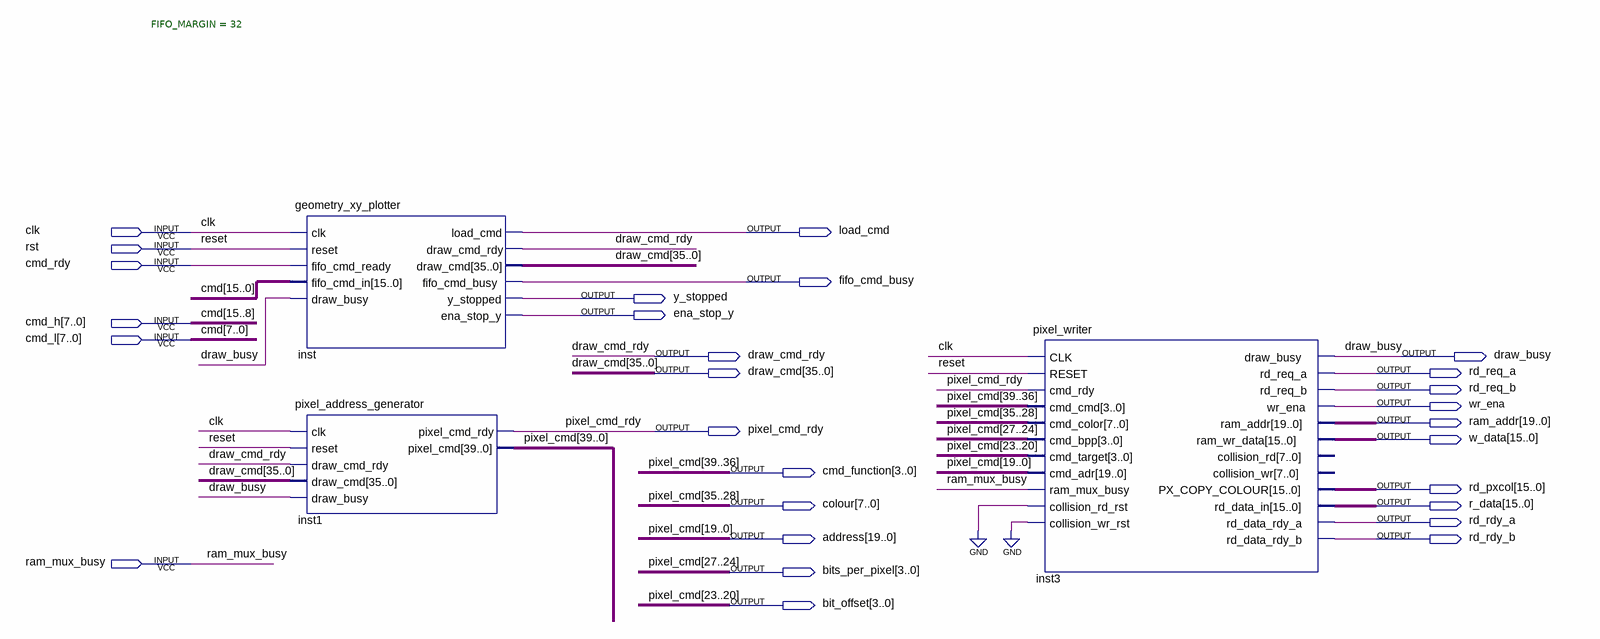
[diagram p0: schematic sheet]
// Quartus schematic geo.bdf as structural Verilog: 3 symbols, 28 pins
module geo (
  input  clk,
  input  rst,
  input  cmd_rdy,
  input  [7:0] cmd_h,
  input  [7:0] cmd_l,
  input  ram_mux_busy,
  output load_cmd,
  output fifo_cmd_busy,
  output y_stopped,
  output ena_stop_y,
  output draw_cmd_rdy,
  output draw_busy,
  output [35:0] draw_cmd,
  output rd_req_a,
  output rd_req_b,
  output wr_ena,
  output [19:0] ram_addr,
  output pixel_cmd_rdy,
  output [15:0] w_data,
  output [3:0] cmd_function,
  output [15:0] rd_pxcol,
  output [7:0] colour,
  output [15:0] r_data,
  output rd_rdy_a,
  output [19:0] address,
  output rd_rdy_b,
  output [3:0] bits_per_pixel,
  output [3:0] bit_offset
);

  geometry_xy_plotter #(.FIFO_MARGIN(32)) inst (
    .clk(clk), .reset(rst), .fifo_cmd_ready(cmd_rdy), .fifo_cmd_in({cmd_h, cmd_l}), .draw_busy(draw_busy),
    .load_cmd(load_cmd), .draw_cmd_rdy(draw_cmd_rdy), .draw_cmd(draw_cmd), .fifo_cmd_busy(fifo_cmd_busy),
    .y_stopped(y_stopped), .ena_stop_y(ena_stop_y));
  pixel_address_generator inst1 (
    .clk(clk), .reset(rst), .draw_cmd_rdy(draw_cmd_rdy), .draw_cmd(draw_cmd), .draw_busy(draw_busy),
    .pixel_cmd_rdy(pixel_cmd_rdy), .pixel_cmd({cmd_function, colour, bits_per_pixel, bit_offset, address}));
  pixel_writer inst3 (
    .CLK(clk), .RESET(rst), .cmd_rdy(pixel_cmd_rdy), .cmd_cmd(cmd_function), .cmd_color(colour),
    .cmd_bpp(bits_per_pixel), .cmd_target(bit_offset), .cmd_adr(address), .ram_mux_busy(ram_mux_busy),
    .collision_rd_rst(1'b0), .collision_wr_rst(1'b0), .draw_busy(draw_busy), .rd_req_a(rd_req_a),
    .rd_req_b(rd_req_b), .wr_ena(wr_ena), .ram_addr(ram_addr), .ram_wr_data(w_data),
    .PX_COPY_COLOUR(rd_pxcol), .rd_data_in(r_data), .rd_data_rdy_a(rd_rdy_a), .rd_data_rdy_b(rd_rdy_b));  // open: collision_rd, collision_wr

  // Other names for the same wires on the sheet: cmd[15:0] = {cmd_h, cmd_l};
  //   pixel_cmd[39:0] = {cmd_function, colour, bits_per_pixel, bit_offset, address}; reset = rst
endmodule
